# EAGLE design takiuino-m18-routed-smashed (EAGLE 7.2.0)
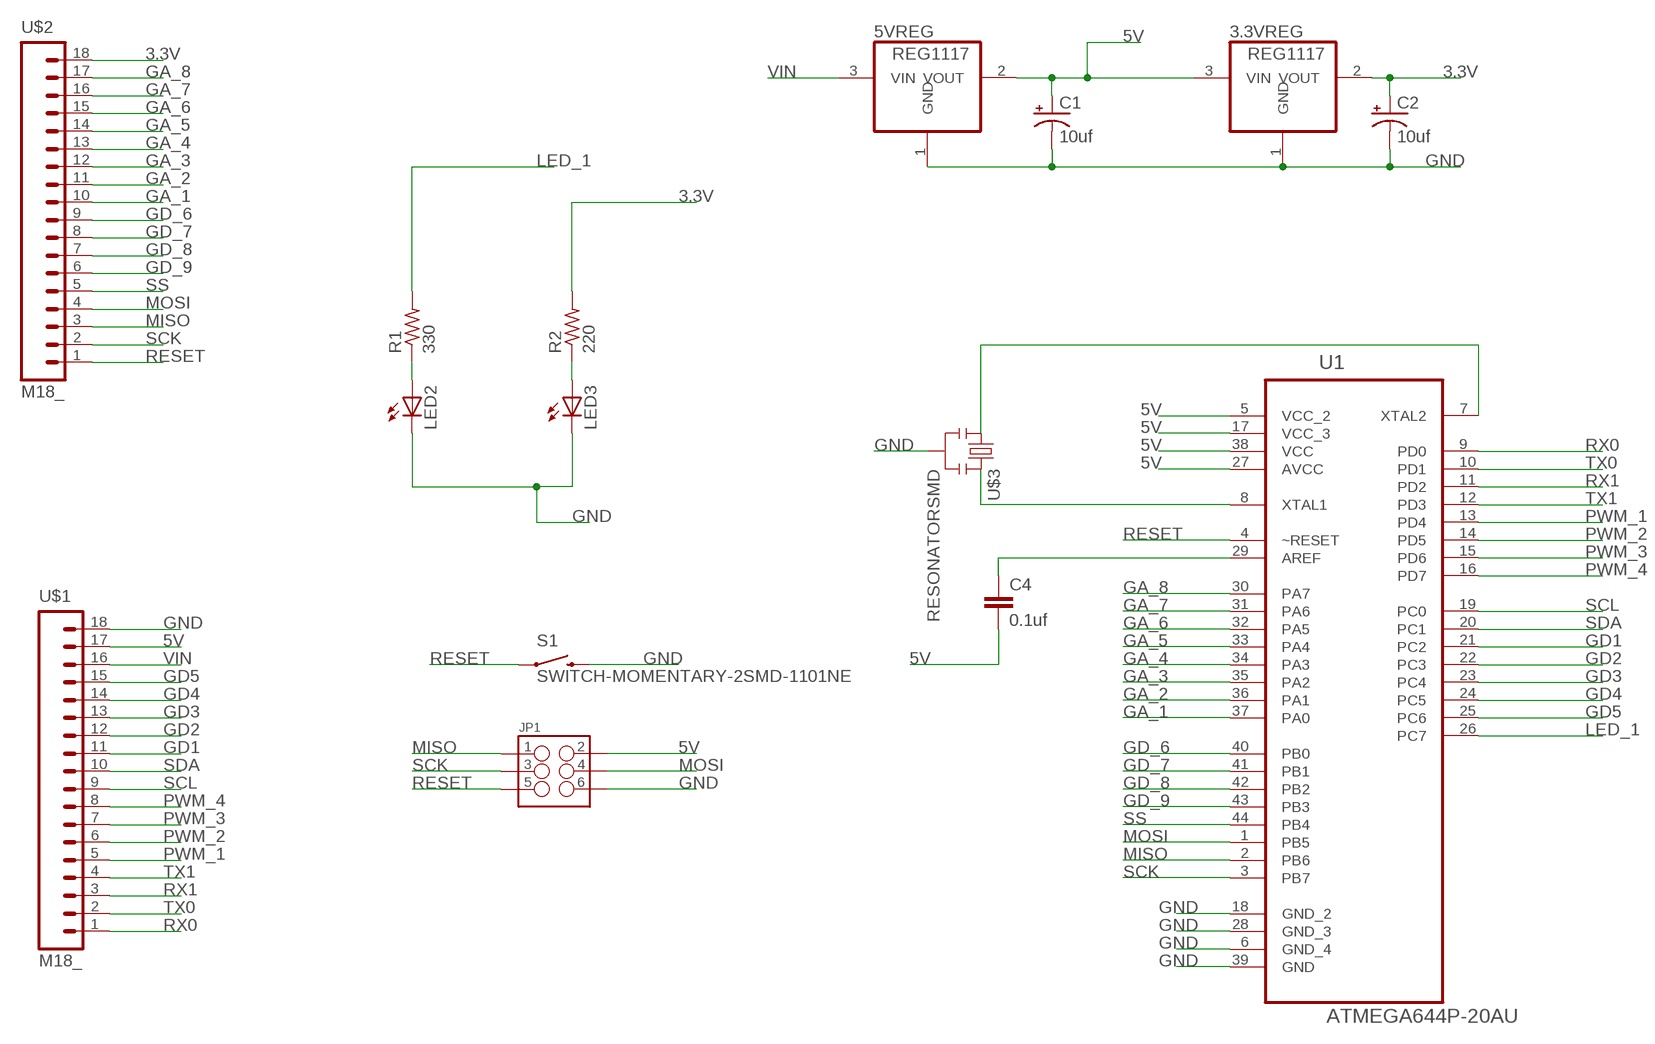
[diagram p0: schematic, sheet 1]

## Parts
3.3VREG  REG1117  [SOT223]
5VREG  REG1117  [SOT223]
C1  10uf  CAP_POL1206  [EIA3216]
C2  10uf  CAP_POL1206  [EIA3216]
C4  0.1uf  CAP0603-CAP  [0603-CAP]
JP1  M03X2NO_SILK  [2X3-NS]
LED2  LEDCHIP-LED0603  [CHIP-LED0603]
LED3  LEDCHIP-LED0603  [CHIP-LED0603]
R1  330  R-US_R0603  [R0603]
R2  220  R-US_R0603  [R0603]
S1  SWITCH-MOMENTARY-2SMD-1101NE  [TACTILE-SWITCH-1101NE]
U1  ATMEGA644P-20AU  [QFP80P1200X1200X120-44N]
U$1  M18_  [1X18]
U$2  M18_  [1X18]
U$3  RESONATORSMD  [RESONATOR-SMD]

## Nets
3.3V: 3.3VREG.2(VOUT) C2.A(+) R2.2 U$2.18
5V: 3.3VREG.3(VIN) 5VREG.2(VOUT) C1.A(+) C4.2 JP1.2 U1.5(VCC_2) U1.17(VCC_3) U1.27(AVCC) U1.38(VCC) U$1.17
GA_1: U1.37(PA0) U$2.10
GA_2: U1.36(PA1) U$2.11
GA_3: U1.35(PA2) U$2.12
GA_4: U1.34(PA3) U$2.13
GA_5: U1.33(PA4) U$2.14
GA_6: U1.32(PA5) U$2.15
GA_7: U1.31(PA6) U$2.16
GA_8: U1.30(PA7) U$2.17
GD1: U1.21(PC2) U$1.11
GD2: U1.22(PC3) U$1.12
GD3: U1.23(PC4) U$1.13
GD4: U1.24(PC5) U$1.14
GD5: U1.25(PC6) U$1.15
GD_6: U1.40(PB0) U$2.9
GD_7: U1.41(PB1) U$2.8
GD_8: U1.42(PB2) U$2.7
GD_9: U1.43(PB3) U$2.6
GND: 3.3VREG.1(GND) 5VREG.1(GND) C1.C(-) C2.C(-) JP1.6 LED2.C LED3.C S1.2 U1.6(GND_4) U1.18(GND_2) U1.28(GND_3) U1.39(GND) U$1.18 U$3.2
LED_1: R1.2 U1.26(PC7)
MISO: JP1.1 U1.2(PB6) U$2.3
MOSI: JP1.4 U1.1(PB5) U$2.4
N$1: U1.8(XTAL1) U$3.3
N$2: U1.7(XTAL2) U$3.1
N$3: C4.1 U1.29(AREF)
N$4: LED2.A R1.1
N$6: LED3.A R2.1
PWM_1: U1.13(PD4) U$1.5
PWM_2: U1.14(PD5) U$1.6
PWM_3: U1.15(PD6) U$1.7
PWM_4: U1.16(PD7) U$1.8
RESET: JP1.5 S1.1 U1.4(~RESET) U$2.1
RX0: U1.9(PD0) U$1.1
RX1: U1.11(PD2) U$1.3
SCK: JP1.3 U1.3(PB7) U$2.2
SCL: U1.19(PC0) U$1.9
SDA: U1.20(PC1) U$1.10
SS: U1.44(PB4) U$2.5
TX0: U1.10(PD1) U$1.2
TX1: U1.12(PD3) U$1.4
VIN [hi]: 5VREG.3(VIN) U$1.16

## Library data of the parts
3.3VREG 5VREG = burr-brown:REG1117: 800mA and 1A Low Dropout (LDO) Positive Regulator 1.8V, 2.5V, 2.85V, 3.3V, 5V, and Adj; MPN: REG1117; OC_FARNELL: 1097566; OC_NEWARK: 14P6981
C1 C2 = SparkFun-Passives:CAP_POL: Capacitor Polarized These are standard SMD and PTH capacitors. Normally 10uF, 47uF, and 100uF in electrolytic and tantalum varieties. Always verify the external diameter of the through hole cap, it varies with capacity, voltage, and manufacturer. The EIA devices should be standard.
C4 = SparkFun-Capacitors:CAP: Capacitor Standard 0603 ceramic capacitor, and 0.1" leaded capacitor.
JP1 = SparkFun-Connectors:M03X2: 2x3 .1" header. Shrouded, with keying- CONN-10681 SMT- CONN-11415 Pogo pins- HW-11044
LED2 LED3 = led:LED: LED OSRAM: - CHIPLED LG R971, LG N971, LY N971, LG Q971, LY Q971, LO R971, LY R971 LH N974, LH R974 LS Q976, LO Q976, LY Q976 LO Q996 - Hyper CHIPLED LW Q18S LB Q993, LB Q99A, LB R99A - SideLED LS A670, LO A670, LY A670, LG A670, LP A670 LB A673, LV A673, LT A673, LW A673 LH A674 LY A675 LS A676, LA A676, LO A676, LY A676, LW A676 LS A679, LY A679, LG A679 - Hyper Micro SIDELED® LS Y876, LA Y876, LO Y876, LY Y876 LT Y87S - SmartLED LW L88C, LW L88S LB L89C, LB L89S, LG L890 LS L89K, LO L89K, LY L89K LS L896, LA L896, LO L896, LY L896 - TOPLED LS T670, LO T670, LY T670, LG T670, LP T670 LSG T670, LSP T670, LSY T670, LOP T670, LYG T670 LG T671, LOG T671, LSG T671 LB T673, LV T673, LT T673, LW T673 LH T674 LS T676, LA T676, LO T676, LY T676, LB T676, LH T676, LSB T676, LW T676 LB T67C, LV T67C, LT T67C, LS T67K, LO T67K, LY T67K, LW E67C LS E67B, LA E67B, LO E67B, LY E67B, LB E67C, LV E67C, LT E67C LW T67C LS T679, LY T679, LG T679 LS T770, LO T770, LY T770, LG T770, LP T770 LB T773, LV T773, LT T773, LW T773 LH T774 LS E675, LA E675, LY E675, LS T675 LS T776, LA T776, LO T776, LY T776, LB T776 LHGB T686 LT T68C, LB T68C - Hyper Mini TOPLED® LB M676 - Mini TOPLED Santana® LG M470 LS M47K, LO M47K, LY M47K Source: http://www.osram.convergy.de LUXEON: - LUMILED® LXK2-PW12-R00, LXK2-PW12-S00, LXK2-PW14-U00, LXK2-PW14-V00 LXK2-PM12-R00, LXK2-PM12-S00, LXK2-PM14-U00 LXK2-PE12-Q00, LXK2-PE12-R00, LXK2-PE12-S00, LXK2-PE14-T00, LXK2-PE14-U00 LXK2-PB12-K00, LXK2-PB12-L00, LXK2-PB12-M00, LXK2-PB14-N00, LXK2-PB14-P00, LXK2-PB14-Q00 LXK2-PR12-L00, LXK2-PR12-M00, LXK2-PR14-Q00, LXK2-PR14-R00 LXK2-PD12-Q00, LXK2-PD12-R00, LXK2-PD12-S00 LXK2-PH12-R00, LXK2-PH12-S00 LXK2-PL12-P00, LXK2-PL12-Q00, LXK2-PL12-R00 Source: www.luxeon.com KINGBRIGHT: KA-3528ASYC Source: www.kingbright.com
R1 R2 = adafruit:R-US_: RESISTOR, American symbol
S1 = SparkFun-Electromechanical:SWITCH-MOMENTARY-2: Various NO switches- pushbuttons, reed, etc; PROD_ID: SWCH-00815
U1 = Atmel_By_element14_Batch_1-00:ATMEGA644P-20AU: 8-bit Microcontroller with Bytes In-System Programmable Flash; MPN: ATMEGA644P-20AU; OC_FARNELL: 1455121; OC_NEWARK: 58M3746; PACKAGE: TQFP-44; SUPPLIER: Atmel
U$1 U$2 = SparkFun-Connectors:M18: 1x18 .1" header
U$3 = SparkFun:RESONATOR: Resonator Small SMD resonator. This is the itty bitty 10/20MHz resonators with built in caps. CSTCE10M0G55 and CSTCE20M0V53. Footprint has been reviewed closely but hasn't been tested yet.

## Net classes
0 default: width 0.203 mm
1 hi: width 0.254 mm

## Board
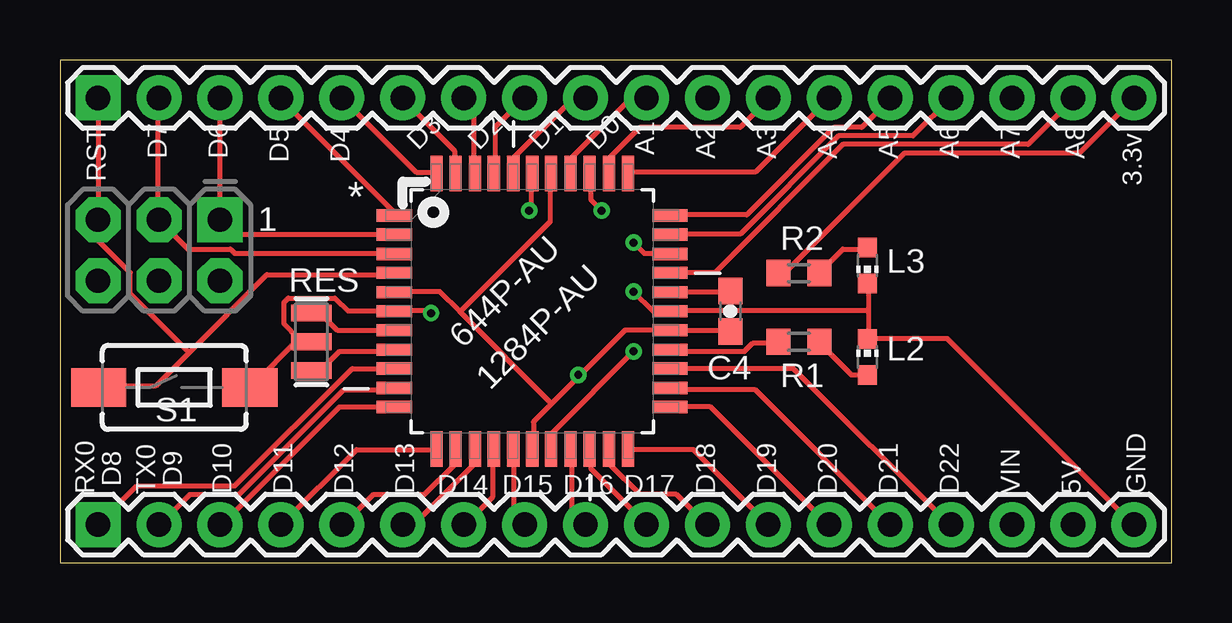
[diagram p1: board, top side]
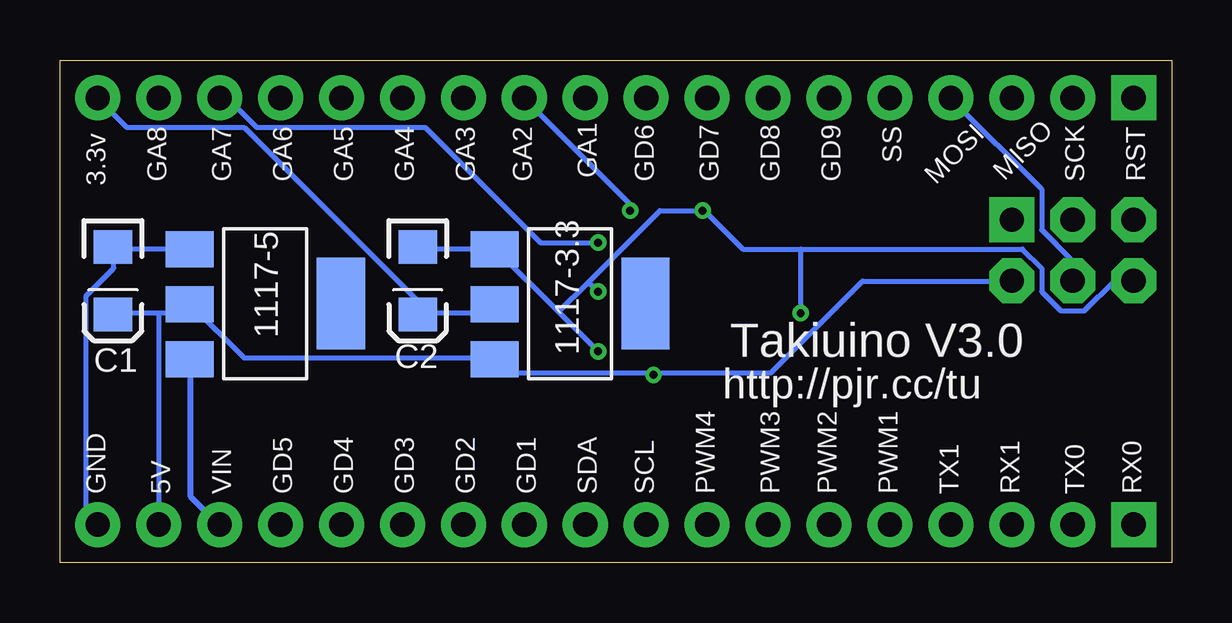
[diagram p2: board, bottom side, seen from below]

Size 46.34 x 20.95 mm. Coordinates in mm from the lower left corner, seen from the top.
Outline: 0,0 46.34,0 46.34,20.95 0,20.95 0,0
Copper layers (1*16): Top 0.0356mm / dielectric 1.5011mm / Bottom 0.0356mm
Design rules "LaenPCBOrder *": minimum track width 6mil, minimum drill 13mil, track to track 6mil, track to pad 6mil, pad to pad 6mil, via to via 16mil, smd to smd 6mil, copper to edge 15mil, drill to drill 6mil, minimum pad ring 7mil, minimum via ring 7mil, stop-mask expansion 3mil, vias tented up to drill 0mil, thermal gap 10mil

### Footprints (pad centres in the part's own frame; a part is rotated, then mirrored left to right if it is on the bottom)
SOT223 = smd 1.499 x 2.007: 1 -2.261,-3.15; 2 0.025,-3.15; 3 2.311,-3.15 | smd 3.81 x 2.007: 4 0,3.15
EIA3216 = smd 1.4 x 1.6: A 1.4,0; C -1.4,0
0603-CAP = smd 1.1 x 1: 1 -0.85,0; 2 0.85,0
2X3-NS = drill 1.016 pad 1.88 square: 1 -2.54,-1.27 | drill 1.016 pad 1.88 octagon: 2 -2.54,1.27; 3 0,-1.27; 4 0,1.27; 5 2.54,-1.27; 6 2.54,1.27
CHIP-LED0603 = smd 0.8 x 0.8: A 0,-0.75; C 0,0.75
R0603 = smd 1 x 1.1: 1 -0.85,0; 2 0.85,0
TACTILE-SWITCH-1101NE = smd 2.3 x 1.6: 1 -3.15,0; 2 3.15,0
QFP80P1200X1200X120-44N = smd 1.473 x 0.508: 1 -5.74,3.988; 2 -5.74,3.2; 3 -5.74,2.388; 4 -5.74,1.6; 5 -5.74,0.787; 6 -5.74,0; 7 -5.74,-0.787; 8 -5.74,-1.6; 9 -5.74,-2.388; 10 -5.74,-3.2; 11 -5.74,-3.988; 23 5.74,-3.988; 24 5.74,-3.2; 25 5.74,-2.388; 26 5.74,-1.6; 27 5.74,-0.787; 28 5.74,0; 29 5.74,0.787; 30 5.74,1.6; 31 5.74,2.388; 32 5.74,3.2; 33 5.74,3.988 | smd 0.508 x 1.473: 12 -3.988,-5.74; 13 -3.2,-5.74; 14 -2.388,-5.74; 15 -1.6,-5.74; 16 -0.787,-5.74; 17 0,-5.74; 18 0.787,-5.74; 19 1.6,-5.74; 20 2.388,-5.74; 21 3.2,-5.74; 22 3.988,-5.74; 34 3.988,5.74; 35 3.2,5.74; 36 2.388,5.74; 37 1.6,5.74; 38 0.787,5.74; 39 0,5.74; 40 -0.787,5.74; 41 -1.6,5.74; 42 -2.388,5.74; 43 -3.2,5.74; 44 -3.988,5.74
1X18 = drill 1.016 pad 1.88 square: 1 0,0 | drill 1.016 pad 1.88: 2 2.54,0; 3 5.08,0; 4 7.62,0; 5 10.16,0; 6 12.7,0; 7 15.24,0; 8 17.78,0; 9 20.32,0; 10 22.86,0; 11 25.4,0; 12 27.94,0; 13 30.48,0; 14 33.02,0; 15 35.56,0; 16 38.1,0; 17 40.64,0; 18 43.18,0
RESONATOR-SMD = smd 0.7 x 1.7: 1 -1.2,0; 2 0,0; 3 1.2,0

### Placement (x,y rotation side)
3.3VREG  25.08,10.79 270 bottom
5VREG  37.78,10.79 270 bottom
C1  44.13,11.75 270 bottom
C2  31.43,11.75 270 bottom
C4  27.94,10.48 270 top
JP1  4.13,13.02 180 top
LED2  33.66,8.57 0 top
LED3  33.66,12.38 180 top
R1  30.8,9.21 180 top
R2  30.8,12.06 180 top
S1  4.76,7.3 0 top
U1  19.68,10.48 0 top
U$1  1.59,1.59 0 top
U$2  1.59,19.37 0 top
U$3  10.48,9.21 270 top

### Tracks (layer width: path | path; a pad name or v marks a point on that pad's centre or on a via)
3.3V
  Top 0.203: R2.2 29.96,12.09 30.23,12.09 35.2,17.07 42.49,17.07 44.72,19.29 U$2.18
  Bottom 0.203: 3.3VREG.2 28.27,10.76 28.63,10.4 31.38,10.4 C2.A 31.38,10.49 31.38,10.85 38.67,18.14 43.56,18.14 44.72,19.29 U$2.18
5V  (via drill 0.33)
  Top 0.203: C4.2 27.91,9.69 U1.27 23.56,9.69 21.65,7.78 | 21.65,7.78 20.49,6.62 | 20.49,6.62 19.74,5.87 19.74,4.8 U1.17 | 20.49,6.62 16.67,10.45 | 16.67,10.45 15.82,11.29 13.96,11.29 U1.5 | 16.67,10.45 20.45,14.22 20.45,16.18 U1.38 | v21.6,7.82 21.65,7.78
  Bottom 0.203: 42.23,10.4 41.34,10.4 40.98,10.76 5VREG.2 40.89,10.76 38.67,8.53 28.27,8.53 3.3VREG.3 28.18,8.45 27.65,7.91 21.6,7.91 | 42.23,10.4 44.09,10.4 C1.A | 21.6,7.91 16.71,7.91 12.89,11.73 6.67,11.73 JP1.2 | 42.23,10.4 U$1.17 | v21.6,7.82 21.6,7.91
GA_1
  Top 0.203: U1.37 21.34,16.27 21.34,16.89 23.74,19.29 24.45,19.29 U$2.10
GA_2  (via drill 0.33)
  Top 0.203: v22.58,14.67 22.14,15.11 22.14,16.18 U1.36
  Bottom 0.203: v22.58,14.67 22.58,14.94 26.94,19.29 U$2.11
GA_3
  Top 0.203: U1.35 22.94,16.27 22.94,16.89 24.18,18.14 28.36,18.14 29.52,19.29 U$2.12
GA_4
  Top 0.203: U1.34 23.74,16.27 28.98,16.27 32,19.29 U$2.13
GA_5
  Top 0.203: U1.33 25.43,14.49 28.63,14.49 32.27,18.14 33.43,18.14 34.58,19.29 U$2.14
GA_6
  Top 0.203: U$2.15 35.56,17.78 32.45,17.78 28.36,13.69 25.43,13.69 U1.32
GA_7  (via drill 0.33)
  Top 0.203: v23.91,13.34 24.36,12.89 25.43,12.89 U1.31
  Bottom 0.203: v23.91,13.34 26.31,13.34 31.11,18.14 38.14,18.14 39.29,19.29 39.65,19.29 U$2.16
GA_8
  Top 0.203: U1.30 27.29,12.09 32.63,17.42 40.36,17.42 42.23,19.29 U$2.17
GD1
  Top 0.203: U1.21 22.94,4.71 22.94,4.09 24.18,2.85 25.69,2.85 26.94,1.6 U$1.11
GD2
  Top 0.203: U$1.12 26.4,4.71 23.74,4.71 U1.22
GD3
  Top 0.203: U1.23 27.11,6.49 32,1.6 U$1.13
GD4
  Top 0.203: U1.24 25.43,7.2 28.98,7.2 34.58,1.6 U$1.14
GD5
  Top 0.203: U1.25 30.58,8.09 37.07,1.6 U$1.15
GD_6
  Top 0.203: U1.40 18.94,16.27 18.94,16.89 21.34,19.29 21.87,19.29 U$2.9
GD_7
  Top 0.203: U$2.8 18.14,18.14 18.14,16.27 U1.41
GD_8
  Top 0.203: U1.42 17.25,16.27 17.25,18.94 16.89,19.29 U$2.7
GD_9
  Top 0.203: U1.43 16.45,16.27 16.45,17.16 14.31,19.29 U$2.6
GND  (via drill 0.33)
  Top 0.203: 33.69,10.49 33.69,11.56 LED3.C | 33.69,10.49 33.69,9.34 LED2.C 33.78,9.34 36.98,9.34 44.72,1.6 U$1.18 | 33.69,10.49 U1.28 25.34,10.49 24.71,10.49 v23.91,11.29 | 9.96,9.34 10.05,9.25 10.4,9.25 U$3.2 9.96,9.34 | 9.96,9.34 9.34,9.96 9.34,10.85 9.51,11.02 11.47,11.02 12,10.49 13.87,10.49 U1.6 14.05,10.49 15.38,10.49 v15.47,10.4 | 9.96,9.34 8,7.38 S1.2 | v23.91,8.8 20.54,5.42 20.54,4.8 U1.18 | v19.56,14.67 19.65,14.76 19.65,16.18 U1.39
  Bottom 0.203: 5VREG.1 40.98,13.07 44.09,13.07 C1.C 44.09,12.98 44.09,12.27 45.25,11.11 45.25,2.04 44.81,1.6 U$1.18 | 25.56,10.45 28.18,13.07 3.3VREG.1 28.27,13.07 31.38,13.07 C2.C | 25.56,10.45 v23.91,8.8 | 25.56,10.45 24.31,11.69 | 24.31,11.69 21.34,14.67 v19.56,14.67 19.47,14.67 17.87,13.07 15.47,13.07 | 15.47,13.07 6.22,13.07 5.42,12.27 5.42,11.29 4.62,10.49 3.65,10.49 2.4,11.73 1.6,11.73 JP1.6 | 15.47,13.07 v15.47,10.4 | 24.31,11.69 v23.91,11.29
LED_1
  Top 0.203: R1.2 29.87,9.16 28.89,9.16 28.54,8.8 25.43,8.8 U1.26
MISO
  Top 0.203: U1.2 13.87,13.69 7.2,13.69 6.67,14.22 JP1.1 U$2.3
MOSI
  Top 0.203: U1.1 13.87,14.49 13.87,14.67 9.25,19.29 U$2.4
  Bottom 0.203: JP1.4 4.18,11.82 4.18,12.62 5.42,13.87 5.42,15.56 9.16,19.29 U$2.4
N$1
  Top 0.203: U1.8 13.87,8.8 11.65,8.8 10.94,8.09 10.49,8.09 U$3.3
N$2
  Top 0.203: U1.7 11.56,9.69 10.85,10.4 U$3.1
N$3
  Top 0.203: C4.1 27.91,11.29 25.43,11.29 U1.29
N$4
  Top 0.203: LED2.A 33.6,7.82 32.98,7.82 31.65,9.16 R1.1
N$6
  Top 0.203: LED3.A 33.6,13.07 32.63,13.07 31.65,12.09 R2.1
PWM_1
  Top 0.203: U1.13 16.45,4.71 16.45,4.09 15.2,2.85 13.07,2.85 11.82,1.6 U$1.5
PWM_2
  Top 0.203: U1.14 17.25,4.71 17.25,4.09 14.76,1.6 14.31,1.6 U$1.6
PWM_3
  Top 0.203: U1.15 18.05,4.71 18.05,2.76 16.89,1.6 U$1.7
PWM_4
  Top 0.203: U1.16 18.94,4.71 18.94,1.96 19.29,1.6 U$1.8
RESET
  Top 0.203: U$2.1 1.6,19.29 1.6,14.31 JP1.5 1.6,14.22 1.6,13.42 2.93,12.09 2.93,11.2 5.38,8.76 | 5.38,8.76 4,7.38 1.69,7.38 S1.1 | 5.38,8.76 8.62,12 13.87,12 U1.4
RX0
  Top 0.203: U1.9 12.18,8.09 7.29,3.2 3.2,3.2 U$1.1
RX1
  Top 0.203: U1.11 11.65,6.49 6.67,1.51 U$1.3
SCK
  Top 0.203: U1.3 13.87,12.89 7.29,12.89 7.11,13.07 5.33,13.07 4.18,14.22 JP1.3 4.09,14.31 4.09,19.29 U$2.2
SCL
  Top 0.203: U1.19 21.34,4.71 21.34,2.13 21.87,1.6 U$1.9
SDA
  Top 0.203: U1.20 22.14,4.71 22.14,3.91 U$1.10
SS
  Top 0.203: U$2.5 14.85,16.27 15.65,16.27 U1.44
TX0
  Top 0.203: U1.10 13.87,7.2 11.82,7.2 7.47,2.85 5.42,2.85 4.18,1.6 U$1.2
TX1
  Top 0.203: U1.12 15.65,4.71 12.36,4.71 9.25,1.6 U$1.4
VIN
  Bottom 0.254: 5VREG.3 40.89,8.45 40.89,2.76 39.74,1.6 U$1.16

### Text on the board
tNames: D7 | D6 | D5 | D4 | D3 | D2 | D1 | D0 | A1 | A2 | A3 | A4 | A5 | A6 | A7 | A8 | RST | 3.3v | 1 | L3 | RES | 644P-AU | C4 | L2 | 1284P-AU | S1 | RX0 | D8 | TX0 | D9 | D10 | D11 | D12 | D13 | D14 | D15 | D16 | D17 | D18 | D19 | D20 | D21 | D22 | VIN | 5V | GND
bNames: SS | RST | SCK | MISO | MOSI | GD9 | GD8 | GD7 | GD6 | GA1 | GA2 | GA3 | GA4 | GA5 | GA6 | GA7 | GA8 | 3.3v | 1117-3.3 | 1117-5 | Takiuino V3.0 | C2 | C1 | http://pjr.cc/tu | RX0 | TX0 | RX1 | TX1 | PWM1 | PWM2 | PWM3 | PWM4 | SCL | SDA | GD1 | GD2 | GD3 | GD4 | GD5 | VIN | 5V | GND